# EAGLE schematic full_power_board (EAGLE 6.4)
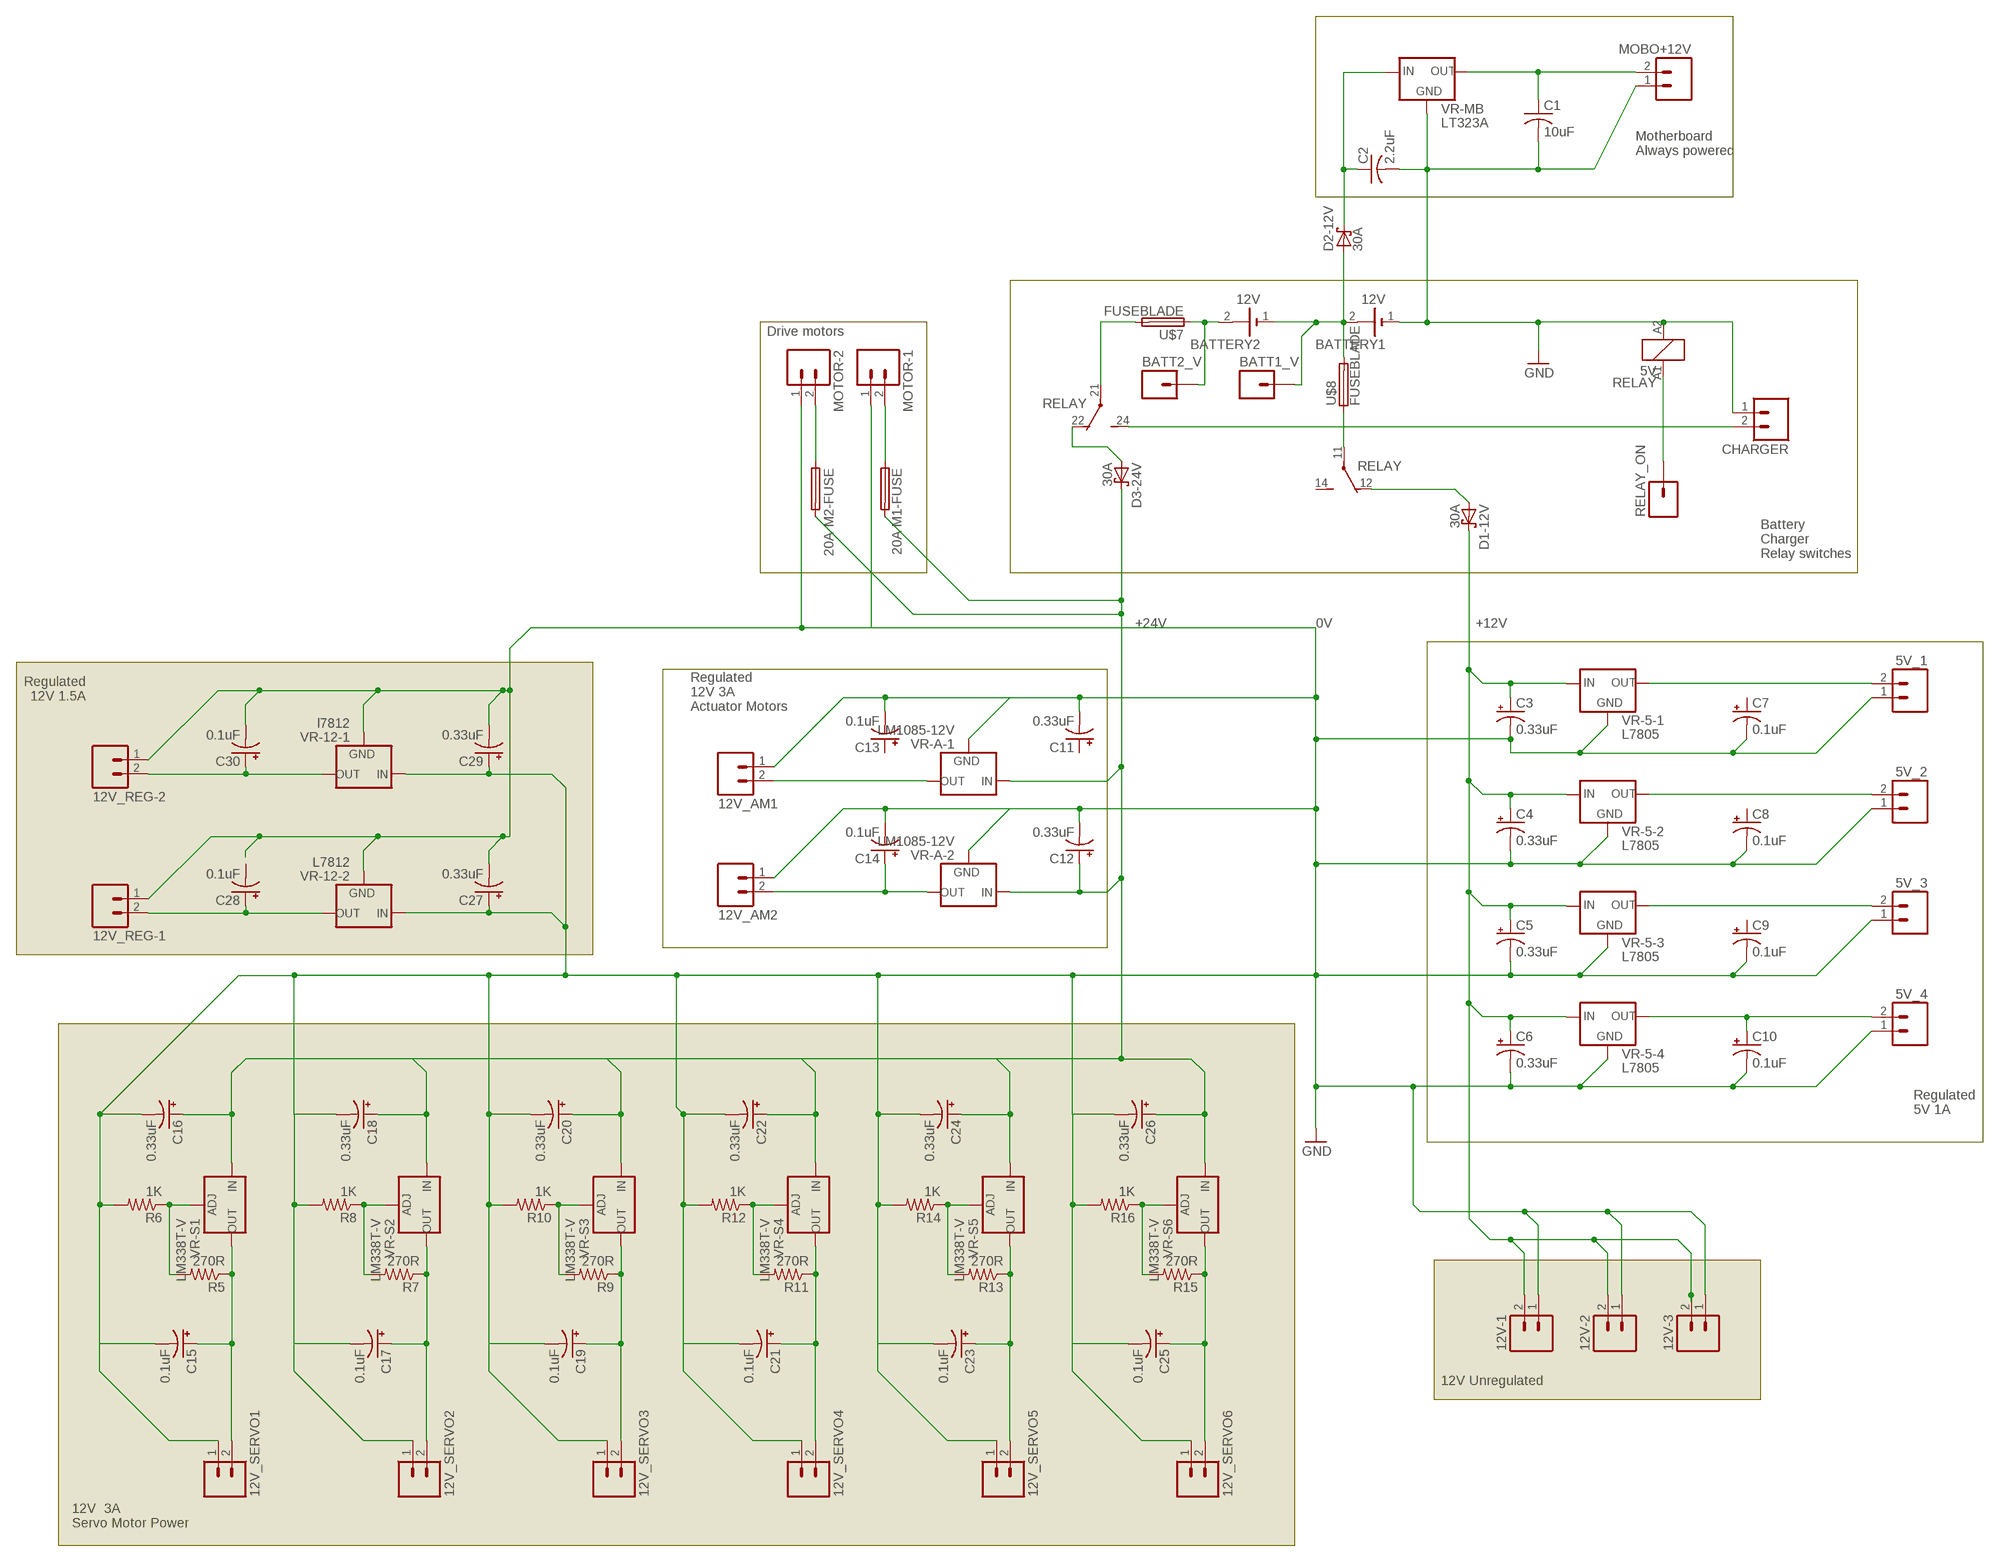
[diagram p0: schematic, sheet 1]

## Parts
5V_1  2-HOLESSC3.81MM  [SCREWTERMINAL-3.81MM]
5V_2  2-HOLESSC3.81MM  [SCREWTERMINAL-3.81MM]
5V_3  2-HOLESSC3.81MM  [SCREWTERMINAL-3.81MM]
5V_4  2-HOLESSC3.81MM  [SCREWTERMINAL-3.81MM]
12V-1  2-HOLESSC3.81MM  [SCREWTERMINAL-3.81MM]
12V-2  2-HOLESSC3.81MM  [SCREWTERMINAL-3.81MM]
12V-3  2-HOLESSC3.81MM  [SCREWTERMINAL-3.81MM]
12V_AM1  2-HOLESSC3.81MM  [SCREWTERMINAL-3.81MM]
12V_AM2  2-HOLESSC3.81MM  [SCREWTERMINAL-3.81MM]
12V_REG-1  2-HOLESSC3.81MM  [SCREWTERMINAL-3.81MM]
12V_REG-2  2-HOLESSC3.81MM  [SCREWTERMINAL-3.81MM]
12V_SERVO1  2-HOLESSC3.81MM  [SCREWTERMINAL-3.81MM]
12V_SERVO2  2-HOLESSC3.81MM  [SCREWTERMINAL-3.81MM]
12V_SERVO3  2-HOLESSC3.81MM  [SCREWTERMINAL-3.81MM]
12V_SERVO4  2-HOLESSC3.81MM  [SCREWTERMINAL-3.81MM]
12V_SERVO5  2-HOLESSC3.81MM  [SCREWTERMINAL-3.81MM]
12V_SERVO6  2-HOLESSC3.81MM  [SCREWTERMINAL-3.81MM]
BATT1_V  1-HOLE  [1-HOLE_BIG]
BATT2_V  1-HOLE  [1-HOLE_BIG]
BATTERY1  12V  BATTERY-ST  [SCREWTERMINAL-5MM]
BATTERY2  12V  BATTERY-ST  [SCREWTERMINAL-5MM]
C1  10uF  CAPACITOR  [C050-024X044]
C2  2.2uF  CAPACITOR  [C050-024X044]
C3  0.33uF  CAPACITOR_POL  [E2,5-5]
C4  0.33uF  CAPACITOR_POL  [E2,5-5]
C5  0.33uF  CAPACITOR_POL  [E2,5-5]
C6  0.33uF  CAPACITOR_POL  [E2,5-5]
C7  0.1uF  CAPACITOR_POL  [E2,5-5]
C8  0.1uF  CAPACITOR_POL  [E2,5-5]
C9  0.1uF  CAPACITOR_POL  [E2,5-5]
C10  0.1uF  CAPACITOR_POL  [E2,5-5]
C11  0.33uF  CAPACITOR_POL  [E2,5-5]
C12  0.33uF  CAPACITOR_POL  [E2,5-5]
C13  0.1uF  CAPACITOR_POL  [E2,5-5]
C14  0.1uF  CAPACITOR_POL  [E2,5-5]
C15  0.1uF  CAPACITOR_POL  [E2,5-5]
C16  0.33uF  CAPACITOR_POL  [E2,5-5]
C17  0.1uF  CAPACITOR_POL  [E2,5-5]
C18  0.33uF  CAPACITOR_POL  [E2,5-5]
C19  0.1uF  CAPACITOR_POL  [E2,5-5]
C20  0.33uF  CAPACITOR_POL  [E2,5-5]
C21  0.1uF  CAPACITOR_POL  [E2,5-5]
C22  0.33uF  CAPACITOR_POL  [E2,5-5]
C23  0.1uF  CAPACITOR_POL  [E2,5-5]
C24  0.33uF  CAPACITOR_POL  [E2,5-5]
C25  0.1uF  CAPACITOR_POL  [E2,5-5]
C26  0.33uF  CAPACITOR_POL  [E2,5-5]
C27  0.33uF  CAPACITOR_POL  [E2,5-5]
C28  0.1uF  CAPACITOR_POL  [E2,5-5]
C29  0.33uF  CAPACITOR_POL  [E2,5-5]
C30  0.1uF  CAPACITOR_POL  [E2,5-5]
CHARGER  24V  2-HOLESSC5MM  [SCREWTERMINAL-5MM]
D1-12V  30A  NTST30100SG-H  [TO22-DIODE-H]
D2-12V  30A  NTST30100SG-H  [TO22-DIODE-H]
D3-24V  30A  NTST30100SG-H  [TO22-DIODE-H]
M1-FUSE  20A  FUSE  [FUSE-5X20MM_SMD]
M2-FUSE  20A  FUSE  [FUSE-5X20MM_SMD]
MOBO+12V  2-HOLESSC3.81MM  [SCREWTERMINAL-3.81MM]
MOTOR-1  2-HOLESSC5MM  [SCREWTERMINAL-5MM]
MOTOR-2  2-HOLESSC5MM  [SCREWTERMINAL-5MM]
R5  270R  RESISTOR0207/2V  [0207/2V]
R6  1K  RESISTOR0207/2V  [0207/2V]
R7  270R  RESISTOR0207/2V  [0207/2V]
R8  1K  RESISTOR0207/2V  [0207/2V]
R9  270R  RESISTOR0207/2V  [0207/2V]
R10  1K  RESISTOR0207/2V  [0207/2V]
R11  270R  RESISTOR0207/2V  [0207/2V]
R12  1K  RESISTOR0207/2V  [0207/2V]
R13  270R  RESISTOR0207/2V  [0207/2V]
R14  1K  RESISTOR0207/2V  [0207/2V]
R15  270R  RESISTOR0207/2V  [0207/2V]
R16  1K  RESISTOR0207/2V  [0207/2V]
RELAY  5V  RT424A05  [RELAY_RT2]
RELAY_ON  1-HOLE"  [1-HOLE]
U$7  FUSEBLADE  [FUSE_BLADE]
U$8  FUSEBLADE  [FUSE_BLADE]
VR-5-1  L7805  L7805ACD2T-TR  [TO263]
VR-5-2  L7805  L7805ACD2T-TR  [TO263]
VR-5-3  L7805  L7805ACD2T-TR  [TO263]
VR-5-4  L7805  L7805ACD2T-TR  [TO263]
VR-12-1  l7812  L7812CD2T-TRTO-263  [TO263]
VR-12-2  L7812  L7812CD2T-TRTO-263  [TO263]
VR-A-1  LM1085-12V  LM1085IT-V  [TO220V]
VR-A-2  LM1085-12V  LM1085IT-V  [TO220V]
VR-MB  LT323A  LT323AT-V  [TO220V]
VR-S1  LM338T-V  [TO220V]
VR-S2  LM338T-V  [TO220V]
VR-S3  LM338T-V  [TO220V]
VR-S4  LM338T-V  [TO220V]
VR-S5  LM338T-V  [TO220V]
VR-S6  LM338T-V  [TO220V]

## Nets
GND: 5V_1.1 5V_2.1 5V_3.1 5V_4.1 12V-1.1 12V-2.1 12V-3.1 12V_AM1.1 12V_AM2.1 12V_REG-1.1 12V_REG-2.1 12V_SERVO1.1 12V_SERVO3.1 12V_SERVO4.1 12V_SERVO5.1 BATTERY1.1(-) C1.2 C2.2 C3.- C4.- C5.- C6.- C7.- C8.- C9.- C10.- C11.- C12.- C13.- C14.- C15.- C16.- C19.- C20.- C21.- C22.- C23.- C24.- C27.+ C27.- C29.+ C29.- C30.- CHARGER.1 MOBO+12V.1 MOTOR-1.1 MOTOR-2.1 R6.2 R10.2 R12.2 R14.2 RELAY.A2 VR-5-1.3(GND) VR-5-2.3(GND) VR-5-3.3(GND) VR-5-4.3(GND) VR-12-1.1(IN) VR-12-1.3(GND) VR-12-2.1(IN) VR-12-2.3(GND) VR-A-1.1(GND) VR-A-2.1(GND) VR-MB.2(GND)
N$1: BATT1_V.P$1 BATTERY1.2(+) BATTERY2.1(-) D2-12V.P$1(A) U$8.P$2
N$2: CHARGER.2 RELAY.24(3:S)
N$3: 12V_REG-1.2 C28.+ VR-12-2.2(OUT)
N$4: D3-24V.P$1(A) RELAY.22(3:O)
N$5: BATT2_V.P$1 BATTERY2.2(+) U$7.P$1
N$6: D1-12V.P$1(A) RELAY.12(2:O)
N$7: 5V_1.2 VR-5-1.2(OUT)
N$8: C1.1 MOBO+12V.2 VR-MB.3(OUT)
N$9: M1-FUSE.P$1 MOTOR-1.2
N$10: M2-FUSE.P$1 MOTOR-2.2
N$11: RELAY.A1 RELAY_ON.1
N$12: C2.1 D2-12V.P$2(C) VR-MB.1(IN)
N$13: 5V_2.2 VR-5-2.2(OUT)
N$14: 5V_3.2 VR-5-3.2(OUT)
N$15: 5V_4.2 C10.+ VR-5-4.2(OUT)
N$17: 12V_AM1.2 VR-A-1.2(OUT)
N$18: 12V_AM2.2 C14.+ VR-A-2.2(OUT)
N$19: R5.2 R6.1 VR-S1.1(ADJ)
N$20: RELAY.21(3:P) U$7.P$2
N$21: 12V_REG-2.2 C30.+ VR-12-1.2(OUT)
N$22: C12.+ C16.+ C26.+ D3-24V.P$2(C) M1-FUSE.P$2 M2-FUSE.P$2 VR-A-1.3(IN) VR-A-2.3(IN) VR-S1.3(IN) VR-S6.3(IN)
N$23: 12V_SERVO1.2 C15.+ R5.1 VR-S1.2(OUT)
N$24: C18.+ VR-S2.3(IN)
N$25: 12V_SERVO2.2 C17.+ R7.1 VR-S2.2(OUT)
N$26: R7.2 R8.1 VR-S2.1(ADJ)
N$27: C20.+ VR-S3.3(IN)
N$28: 12V_SERVO3.2 C19.+ R9.1 VR-S3.2(OUT)
N$29: R9.2 R10.1 VR-S3.1(ADJ)
N$30: C22.+ VR-S4.3(IN)
N$31: 12V_SERVO4.2 C21.+ R11.1 VR-S4.2(OUT)
N$32: R11.2 R12.1 VR-S4.1(ADJ)
N$33: C24.+ VR-S5.3(IN)
N$34: 12V_SERVO5.2 C23.+ R13.1 VR-S5.2(OUT)
N$35: R13.2 R14.1 VR-S5.1(ADJ)
N$36: 12V-1.2 12V-2.2 12V-3.2 C3.+ C4.+ C5.+ C6.+ D1-12V.P$2(C) VR-5-1.1(IN) VR-5-2.1(IN) VR-5-3.1(IN) VR-5-4.1(IN)
N$37: 12V_SERVO6.2 C25.+ R15.1 VR-S6.2(OUT)
N$38: R15.2 R16.1 VR-S6.1(ADJ)
N$39: RELAY.11(2:P) U$8.P$1
N$40: 12V_SERVO2.1 C17.- C18.- R8.2
N$44: 12V_SERVO6.1 C25.- C26.- R16.2
Unconnected: C7.+ C8.+ C9.+ C11.+ C13.+ C28.- RELAY.14(2:S)

## Notes on the sheet
- Motherboard
  Always powered
- Drive motors
- Battery
  Charger
  Relay switches
- +24V | 0V | +12V
- Regulated
  12V 1.5A
- Regulated
  12V 3A
  Actuator Motors
- Regulated
  5V 1A
- 12V Unregulated
- 12V  3A
  Servo Motor Power

## Library data of the parts
5V_1-5V_4 12V-1-12V-3 12V_AM1 12V_AM2 12V_REG-1 12V_REG-2 12V_SERVO1-12V_SERVO6 CHARGER MOBO+12V MOTOR-1 MOTOR-2 = parts:2-HOLES: TERMINAL 2-PIN Holes for connecting 2 pin terminal
BATT1_V BATT2_V RELAY_ON = parts:1-HOLE: ONE HOLE Single hole on board
BATTERY1 BATTERY2 = parts:BATTERY: BATTERY battery with hole variants to mount to board
C1 C2 = parts:CAPACITOR: CAPACITOR, American symbol
C3-C30 = parts:CAPACITOR_POL: POLARIZED CAPACITOR, American symbol
D1-12V D2-12V D3-24V = parts:NTST30100SG: <DIODE NTST30100SG Schottky 100V 30A rectifier
M1-FUSE M2-FUSE U$7 U$8 = parts:FUSE: FUSE
R5-R16 = parts:RESISTOR: RESISTOR
RELAY = parts:RT424A: Relay DPDT DPDT relay 8A contact 5V coil; MPN: RT424A05; OC_FARNELL: unknown; OC_NEWARK: 48M7975
VR-5-1-VR-5-4 = parts:L7805ACD2T-TR: VOLTAGE REGULATOR 5V 1A surface mount voltage regulator
VR-12-1 VR-12-2 = parts:L7812CD2T-TR: VOLTAGE REGULATOR 12V 1.5A voltage regulator
VR-A-1 VR-A-2 = parts:LM1085IT: VOLTAGE REGULATOR 12V 3A voltage regulator
VR-MB = parts:LT323AT: VOLTAGE REGULATOR 5V 3A voltage regulator
VR-S1-VR-S6 = parts:LM338T: VOLTAGE REGULATOR Adjustable 1.2V to 32V 5A voltage regulator